# EAGLE design gun (EAGLE 7.4.0)
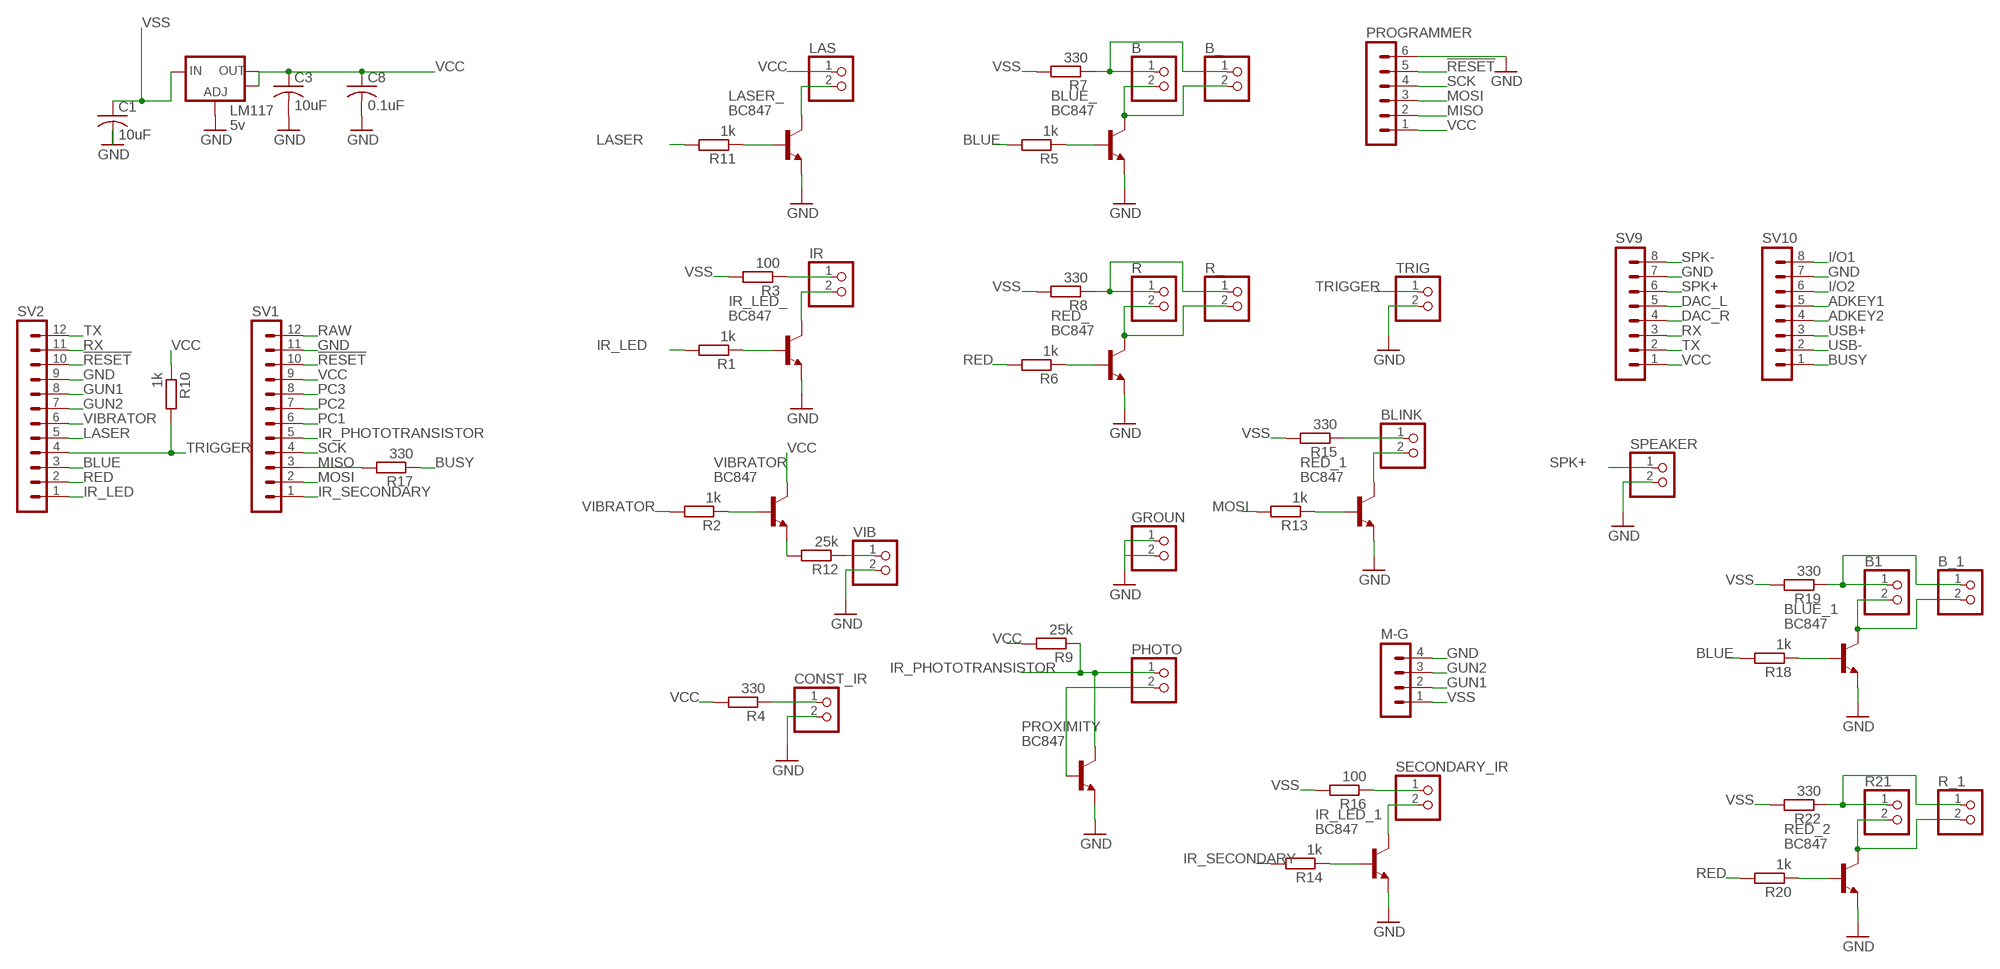
[diagram p0: schematic, sheet 1]

## Parts
B  PINHD-1X2  [1X02]
B1  PINHD-1X2  [1X02]
B_  PINHD-1X2  [1X02]
B_1  PINHD-1X2  [1X02]
BLINK  PINHD-1X2  [1X02]
BLUE_  BC847  [SOT23]
BLUE_1  BC847  [SOT23]
C1  10uF  C-USC0805  [C0805]
C3  10uF  C-USC0805  [C0805]
C8  0.1uF  C-USC0805  [C0805]
CONST_IR  PINHD-1X2  [1X02]
GROUN  PINHD-1X2  [1X02]
IR  PINHD-1X2  [1X02]
IR_LED_  BC847  [SOT23]
IR_LED_1  BC847  [SOT23]
LAS  PINHD-1X2  [1X02]
LASER_  BC847  [SOT23]
LM117  5v  V_REG_LM1117SOT223  [SOT223]
M-G  MA04-1  [MA04-1]
PHOTO  PINHD-1X2  [1X02]
PROGRAMMER  MA06-1  [MA06-1]
PROXIMITY  BC847  [SOT23]
R  PINHD-1X2  [1X02]
R1  1k  R-EU_M1206  [M1206]
R2  1k  R-EU_M1206  [M1206]
R3  100  R-EU_M1206  [M1206]
R4  330  R-EU_M1206  [M1206]
R5  1k  R-EU_M1206  [M1206]
R6  1k  R-EU_M1206  [M1206]
R7  330  R-EU_M1206  [M1206]
R8  330  R-EU_M1206  [M1206]
R9  25k  R-EU_M1206  [M1206]
R10  1k  R-EU_M1206  [M1206]
R11  1k  R-EU_M1206  [M1206]
R12  25k  R-EU_M1206  [M1206]
R13  1k  R-EU_M1206  [M1206]
R14  1k  R-EU_M1206  [M1206]
R15  330  R-EU_M1206  [M1206]
R16  100  R-EU_M1206  [M1206]
R17  330  R-EU_M1206  [M1206]
R18  1k  R-EU_M1206  [M1206]
R19  330  R-EU_M1206  [M1206]
R20  1k  R-EU_M1206  [M1206]
R21  PINHD-1X2  [1X02]
R22  330  R-EU_M1206  [M1206]
R_  PINHD-1X2  [1X02]
R_1  PINHD-1X2  [1X02]
RED_  BC847  [SOT23]
RED_1  BC847  [SOT23]
RED_2  BC847  [SOT23]
SECONDARY_IR  PINHD-1X2  [1X02]
SPEAKER  PINHD-1X2  [1X02]
SV1  MA12-1  [MA12-1]
SV2  MA12-1  [MA12-1]
SV9  MA08-1  [MA08-1]
SV10  MA08-1  [MA08-1]
TRIG  PINHD-1X2  [1X02]
VIB  PINHD-1X2  [1X02]
VIBRATOR  BC847  [SOT23]

## Nets
!RESET: PROGRAMMER.5 SV1.10 SV2.10
ADKEY1: SV10.5
ADKEY2: SV10.4
BLUE: R5.2 R18.2 SV2.3
BUSY: R17.1 SV10.1
DAC_L: SV9.5
DAC_R: SV9.4
GND: BLUE_1.2(E) BLUE_.2(E) C1.2 C3.2 C8.2 CONST_IR.2 GROUN.1 GROUN.2 IR_LED_1.2(E) IR_LED_.2(E) LASER_.2(E) LM117.1(ADJ) M-G.4 PROGRAMMER.6 PROXIMITY.2(E) RED_1.2(E) RED_2.2(E) RED_.2(E) SPEAKER.2 SV1.11 SV2.9 SV9.7 SV10.7 TRIG.2 VIB.2
GUN1: M-G.2 SV2.8
GUN2: M-G.3 SV2.7
I/O1: SV10.8
I/O2: SV10.6
IR_LED: R1.2 SV2.1
IR_PHOTOTRANSISTOR: PHOTO.1 PROXIMITY.3(C) R9.1 SV1.5
IR_SECONDARY: R14.2 SV1.1
LASER: R11.2 SV2.5
MISO: PROGRAMMER.2 R17.2 SV1.3
MOSI: PROGRAMMER.3 R13.2 SV1.2
N$1: PHOTO.2 PROXIMITY.1(B)
N$2: R12.1 VIB.1
N$3: IR_LED_.1(B) R1.1
N$4: R2.1 VIBRATOR.1(B)
N$5: R12.2 VIBRATOR.2(E)
N$6: IR.1 R3.1
N$7: IR.2 IR_LED_.3(C)
N$8: CONST_IR.1 R4.1
N$9: LAS.2 LASER_.3(C)
N$10: R13.1 RED_1.1(B)
N$11: BLUE_.1(B) R5.1
N$12: B.2 B_.2 BLUE_.3(C)
N$13: R6.1 RED_.1(B)
N$14: R.2 R_.2 RED_.3(C)
N$15: B.1 B_.1 R7.1
N$16: R8.1 R.1 R_.1
N$17: BLINK.2 RED_1.3(C)
N$18: BLINK.1 R15.1
N$20: LASER_.1(B) R11.1
N$22: IR_LED_1.1(B) R14.1
N$23: IR_LED_1.3(C) SECONDARY_IR.2
N$24: R16.1 SECONDARY_IR.1
N$25: BLUE_1.1(B) R18.1
N$26: B1.2 B_1.2 BLUE_1.3(C)
N$27: B1.1 B_1.1 R19.1
N$28: R20.1 RED_2.1(B)
N$29: R21.2 R_1.2 RED_2.3(C)
N$30: R21.1 R22.1 R_1.1
PC1: SV1.6
PC2: SV1.7
PC3: SV1.8
RAW: SV1.12
RED: R6.2 R20.2 SV2.2
RX: SV2.11 SV9.3
SCK: PROGRAMMER.4 SV1.4
SPK+: SPEAKER.1 SV9.6
SPK-: SV9.8
TRIGGER: R10.2 SV2.4 TRIG.1
TX: SV2.12 SV9.2
USB+: SV10.3
USB-: SV10.2
VCC: C3.1 C8.1 LAS.1 LM117.2(OUT) LM117.4(OUT) PROGRAMMER.1 R4.2 R9.2 R10.1 SV1.9 SV9.1 VIBRATOR.3(C)
VIBRATOR: R2.2 SV2.6
VSS: C1.1 LM117.3(IN) M-G.1 R3.2 R7.2 R8.2 R15.2 R16.2 R19.2 R22.2

## Library data of the parts
B B1 B_ B_1 BLINK CONST_IR GROUN IR LAS PHOTO R R21 R_ R_1 SECONDARY_IR SPEAKER TRIG VIB = pinhead:PINHD-1X2: PIN HEADER
BLUE_ BLUE_1 IR_LED_ IR_LED_1 LASER_ PROXIMITY RED_ RED_1 RED_2 VIBRATOR = transistor:BC847: NPN TRANSISTOR
C1 C3 C8 = resistor:C-US: CAPACITOR, American symbol
LM117 = SparkFun:V_REG_LM1117: Voltage Regulator LM1117 Standard adjustable voltage regulator but in SMD form. Spark Fun Electronics SKU : COM-00595
M-G = con-lstb:MA04-1: PIN HEADER; OC_FARNELL: unknown; OC_NEWARK: unknown
PROGRAMMER = con-lstb:MA06-1: PIN HEADER; OC_FARNELL: unknown; OC_NEWARK: unknown
R1-R9 R11-R20 R22 = resistor:R-EU_: RESISTOR, European symbol
R10 = rcl:R-EU_: RESISTOR, European symbol
SV1 SV2 = con-lstb:MA12-1: PIN HEADER; OC_FARNELL: unknown; OC_NEWARK: unknown
SV9 SV10 = con-lstb:MA08-1: PIN HEADER; OC_FARNELL: unknown; OC_NEWARK: unknown

## Board
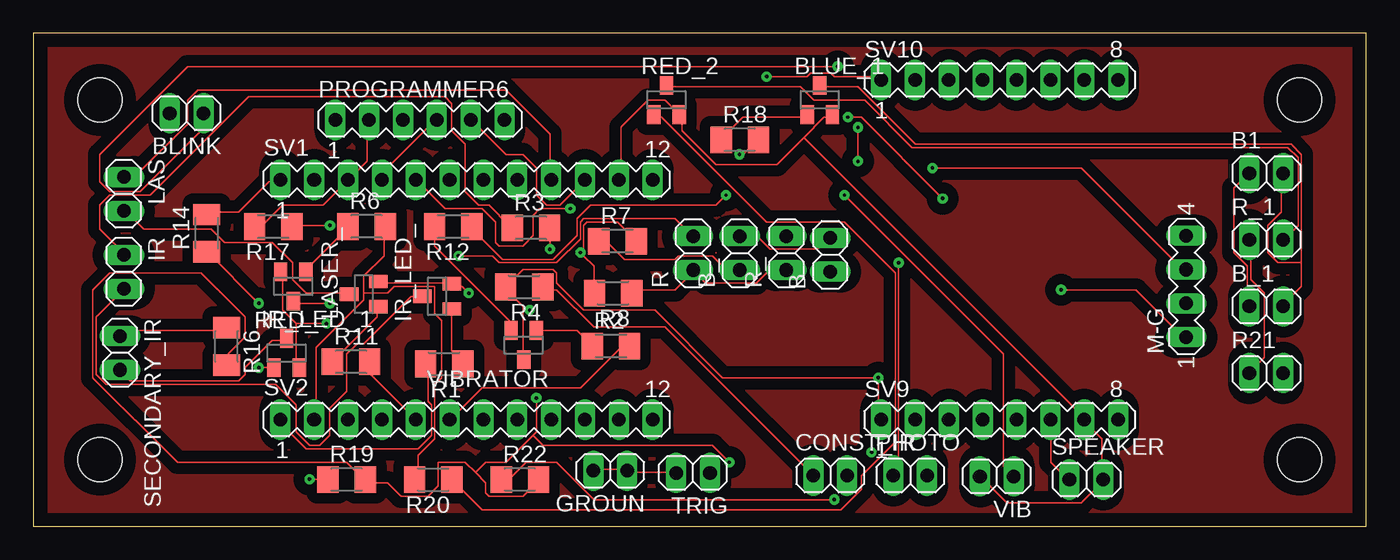
[diagram p1: board, top side]
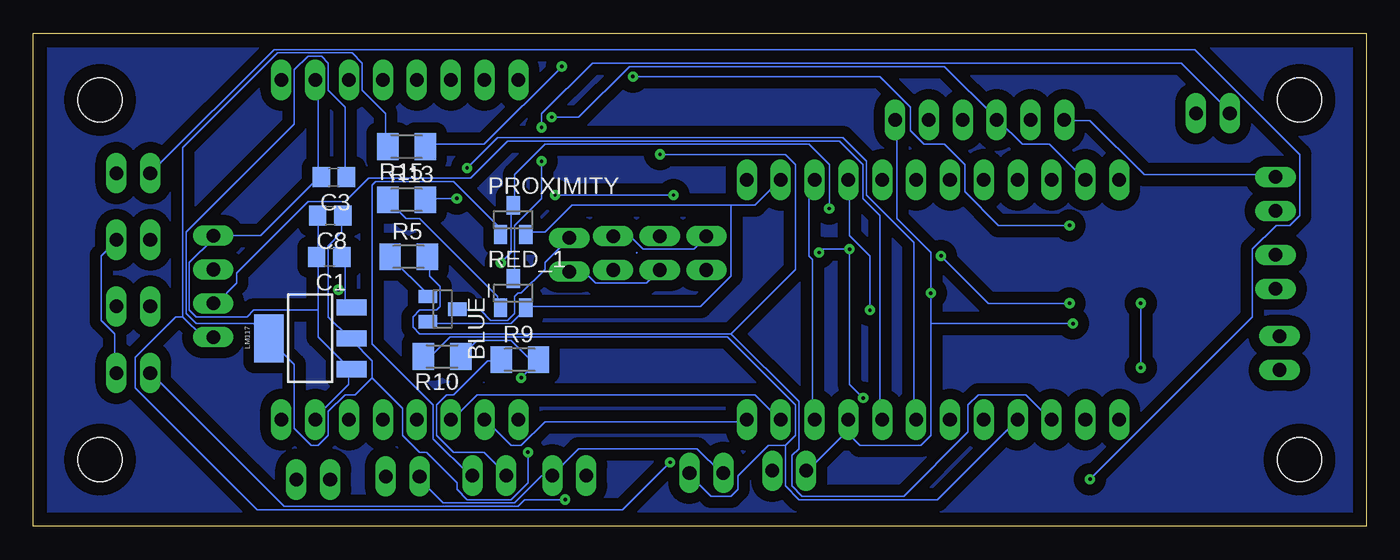
[diagram p2: board, bottom side, seen from below]

Size 100 x 37 mm. Coordinates in mm from the lower left corner, seen from the top.
Outline: 0,0 100,0 100,37 0,37 0,0
Copper layers (1*16): Top 0.035mm / dielectric 1.5mm / Bottom 0.035mm
Design rules "default *": minimum track width 5mil, minimum drill 10mil, track to track 5mil, track to pad 5mil, pad to pad 5mil, via to via 5mil, smd to smd 5mil, copper to edge 40mil, drill to drill 10mil, minimum pad ring 10mil, minimum via ring 10mil, stop-mask expansion 4mil, vias tented up to drill 0mil, thermal gap 10mil
Holes 3.3 mm at 5,32 5,5 95,32 95,5

### Footprints (pad centres in the part's own frame; a part is rotated, then mirrored left to right if it is on the bottom)
1X02 = drill 1.016 long: 1 -1.27,0; 2 1.27,0
SOT23 = smd 1 x 1.4: 1 -0.95,-1.1; 2 0.95,-1.1; 3 0,1.1
C0805 = smd 1.3 x 1.5: 1 -0.95,0; 2 0.95,0
SOT223 = smd 1.219 x 2.235: 1 -2.311,-3.099; 2 0,-3.099; 3 2.311,-3.099 | smd 3.6 x 2.2: 4 0,3.099
MA04-1 = drill 1.016 long: 1 -3.81,0; 2 -1.27,0; 3 1.27,0; 4 3.81,0
MA06-1 = drill 1.016 long: 1 -6.35,0; 2 -3.81,0; 3 -1.27,0; 4 1.27,0; 5 3.81,0; 6 6.35,0
M1206 = smd 1.6 x 2: 1 -1.4,0; 2 1.4,0
MA12-1 = drill 1.016 long: 1 -13.97,0; 2 -11.43,0; 3 -8.89,0; 4 -6.35,0; 5 -3.81,0; 6 -1.27,0; 7 1.27,0; 8 3.81,0; 9 6.35,0; 10 8.89,0; 11 11.43,0; 12 13.97,0
MA08-1 = drill 1.016 long: 1 -8.89,0; 2 -6.35,0; 3 -3.81,0; 4 -1.27,0; 5 1.27,0; 6 3.81,0; 7 6.35,0; 8 8.89,0

### Placement (x,y rotation side)
B  59.79,20.38 90 top
B1  92.5,26.5 0 top
B_  53,20.5 90 top
B_1  92.5,16.5 0 top
BLINK  11.5,31 180 top
BLUE_  69.29,16.3 270 bottom
BLUE_1  59,32 0 top
C1  77.79,20.2 180 bottom
C3  77.45,26.2 180 bottom
C8  77.72,23.32 180 bottom
CONST_IR  59.79,3.81 0 top
GROUN  43.29,4.16 180 top
IR  6.79,19.09 270 top
IR_LED_  30.29,17.26 90 top
IR_LED_1  19,13 0 top
LAS  6.79,24.94 270 top
LASER_  24.79,17.42 90 top
LM117  79.22,14.1 90 bottom
M-G  86.5,18 90 top
PHOTO  65.79,3.81 0 top
PROGRAMMER  29,30.5 0 top
PROXIMITY  64,23 0 bottom
R  49.5,20.5 90 top
R1  30.83,12.18 180 top
R2  43.33,13.52 0 top
R3  37.33,22.39 0 top
R4  36.83,17.96 180 top
R5  71.83,20.22 0 bottom
R6  25,22.5 0 top
R7  43.83,21.4 0 top
R8  43.5,17.5 180 top
R9  63.5,12.5 0 bottom
R10  69.33,12.74 180 bottom
R11  23.83,12.34 0 top
R12  31.5,22.5 180 top
R13  72,24.5 0 bottom
R14  13,22 90 top
R15  72,28.5 180 bottom
R16  14.5,13.5 270 top
R17  18,22.5 180 top
R18  53,29 0 top
R19  23.5,3.5 0 top
R20  30,3.5 180 top
R21  92.5,11.5 0 top
R22  36.5,3.5 0 top
R_  56.5,20.5 90 top
R_1  92.5,21.5 0 top
RED_  19.5,18 180 top
RED_1  64,17.5 0 bottom
RED_2  47.5,32 0 top
SECONDARY_IR  6.5,13 270 top
SPEAKER  79,3.5 0 top
SV1  32.5,26 0 top
SV2  32.5,8 0 top
SV9  72.5,8 0 top
SV10  72.5,33.5 0 top
TRIG  49.5,4 180 top
VIB  72.29,3.74 180 top
VIBRATOR  36.79,13.6 180 top

### Tracks (layer width: path | path; a pad name or v marks a point on that pad's centre or on a via)
!RESET
  Top 0.127: PROGRAMMER.5 32.92,30.45 35.46,27.91 36.73,27.91 37.74,26.89 37.74,24.86 38.5,24.1 39.52,24.1 41.3,25.88 SV1.10
  Bottom 0.127: SV2.10 41.55,8.1 41.55,20.03 41.81,20.29 41.81,25.62 41.55,25.88 SV1.10
BLUE  (via drill 0.25)
  Top 0.127: v52.98,27.91 53.24,27.91 54.25,28.92 R18.2
  Bottom 0.127: 47.65,14.45 71.02,14.45 71.52,14.95 71.52,15.72 71.02,16.22 69.75,16.22 69.49,16.48 69.49,18 70.25,18.76 70.25,20.03 R5.2 | 47.65,14.45 42.57,9.37 42.57,5.81 43.08,5.3 43.08,3.02 42.31,2.25 34.69,2.25 29.87,7.08 29.87,9.11 29.11,9.87 25.55,9.87 23.77,8.1 SV2.3 | v52.98,27.91 43.58,27.91 42.82,27.15 42.82,19.27 47.65,14.45
BUSY  (via drill 0.25)
  Top 0.127: v22.25,22.57 19.45,22.57 R17.1 | v55.01,33.75 58.06,33.75 58.32,34 59.84,34 60.09,33.75 63.4,33.75 SV10.1
  Bottom 0.127: v22.25,22.57 27.58,22.57 30.12,25.11 30.12,27.15 31.65,28.67 33.17,28.67 34.19,29.69 34.19,31.46 36.47,33.75 v55.01,33.75
GND  (via drill 0.25)
  Top 0.127: 19.71,15.21 19.71,11.91 IR_LED_1.2 | 19.71,15.21 18.69,16.22 18.69,19.02 RED_.2 | LASER_.2 26.06,18.26 31.14,18.26 IR_LED_.2 31.39,18 32.15,18 v32.66,17.49 | GROUN.2 42.06,4.29 44.35,4.29 GROUN.1 44.6,4.03 48.16,4.03 TRIG.2 | v21.99,15.21 19.71,15.21 | SV1.11 44.09,26.13 44.09,29.94 46.12,31.97 47.39,31.97 48.41,30.96 RED_2.2 48.66,30.7 48.66,29.69 51.2,27.15 55.78,27.15 57.81,29.18 | 57.81,29.18 59.33,30.7 59.84,30.7 BLUE_1.2 | VIB.2 71.27,3.52 73.05,1.75 78.64,1.75 80.16,3.27 SPEAKER.2 80.16,3.52 80.16,6.57 78.89,7.84 SV9.7 78.89,8.1 57.81,29.18
  Bottom 0.127: 39.01,7.08 39.01,7.84 SV2.9 39.01,7.08 | 39.01,7.08 41.81,4.29 GROUN.2 | 32.66,15.21 32.66,6.83 33.42,6.06 38,6.06 39.01,7.08 | 32.66,15.21 v32.66,17.49 32.66,20.54 35.2,23.08 35.2,30.45 PROGRAMMER.6 | 32.66,15.21 v21.99,15.21 | BLUE_.2 70.25,15.21 64.16,15.21 63.14,16.22 RED_1.2 62.89,16.48 49.93,16.48 47.65,18.76 47.65,24.1 | 47.65,24.1 45.87,24.1 44.09,25.88 SV1.11 | 47.65,24.1 59.59,24.1 61.62,22.07 62.89,22.07 PROXIMITY.2 | SV10.7 78.64,33.5 78.64,26.38 C3.2 78.64,26.13 82.95,21.81 86.26,21.81 M-G.4 86.51,21.56 88.29,19.78 88.29,16.22 87.78,15.72 83.97,15.72 83.46,16.22 78.64,16.22 | C8.2 78.64,23.08 78.64,20.29 C1.2 78.64,20.03 78.64,16.22 | SV9.7 78.89,8.1 76.35,10.64 76.35,11.65 LM117.1 76.35,11.91 78.64,14.19 78.64,16.22 | VIB.2 71.02,3.52 69.24,1.75 63.9,1.75 61.87,3.78 61.11,3.78 CONST_IR.2 60.86,4.03 59.08,5.81 50.19,5.81 48.41,4.03 TRIG.2
GUN1
  Bottom 0.127: SV2.8 36.47,8.1 36.47,23.34 37.74,24.61 37.74,27.15 39.52,28.92 64.41,28.92 67.21,26.13 74.83,26.13 76.6,24.35 79.4,24.35 84.73,19.02 84.73,18.26 86.26,16.73 M-G.2
GUN2  (via drill 0.25)
  Top 0.127: v67.46,26.89 78.64,26.89 86.26,19.27 M-G.3
  Bottom 0.127: v67.46,26.89 65.17,29.18 39.27,29.18 37.49,27.4 37.49,24.86 33.93,21.3 33.93,8.1 SV2.7
IR_LED
  Top 0.127: R1.2 29.61,12.16 29.61,9.37 29.87,9.11 29.87,6.83 28.85,5.81 20.47,5.81 18.44,7.84 SV2.1
IR_PHOTOTRANSISTOR  (via drill 0.25)
  Top 0.127: v64.92,19.78 64.92,4.29 64.67,4.03 PHOTO.1 | v40.28,23.84 38,23.84 37.49,23.34 37.49,21.81 36.73,21.05 34.95,21.05 34.69,21.3 34.69,22.83 33.68,23.84 30.88,23.84 28.85,25.88 SV1.5
  Bottom 0.127: v64.92,19.78 64.16,20.54 64.16,24.1 PROXIMITY.3 63.9,24.35 63.9,26.38 61.62,28.67 41.81,28.67 40.28,27.15 v40.28,23.84 | R9.1 64.92,12.41 65.94,12.41 68.48,9.87 68.98,9.87 69.75,9.11 69.75,6.83 68.48,5.56 66.19,5.56 64.67,4.03 PHOTO.1
IR_SECONDARY
  Top 0.127: R14.2 13.1,23.59 15.39,23.59 17.68,25.88 18.44,25.88 SV1.1
LASER
  Top 0.127: R11.2 25.3,12.16 25.3,11.4 28.6,8.1 SV2.5
MISO
  Top 0.127: R17.2 16.66,22.57 17.17,22.57 18.69,24.1 21.74,24.1 23.52,25.88 SV1.3 23.77,26.13 25.04,27.4 25.04,30.45 PROGRAMMER.2
MOSI  (via drill 0.25)
  Top 0.127: v68.22,24.61 62.13,30.7 v61.11,30.7
  Bottom 0.127: v68.22,24.61 70.51,24.61 R13.2 | v61.11,30.7 59.08,30.7 55.27,34.51 31.65,34.51 27.84,30.7 PROGRAMMER.3 27.58,30.45 25.8,28.67 23.77,28.67 21.23,26.13 SV1.2
N$1
  Bottom 0.127: PROXIMITY.1 65.17,22.07 65.17,22.57 68.48,25.88 74.32,25.88 74.57,25.62 74.57,13.68 70,9.11 70,6.57 67.21,3.78 PHOTO.2
N$2  (via drill 0.25)
  Top 0.127: v51.97,24.86 51.2,24.1 41.81,24.1 40.79,23.08 40.79,21.81 39.01,20.03 35.2,20.03 32.92,22.32 R12.1 | v60.86,24.86 72.79,12.92 72.79,4.54 73.56,3.78 VIB.1
  Bottom 0.127: v60.86,24.86 v51.97,24.86
N$3
  Top 0.127: IR_LED_.1 31.39,16.22 31.39,13.18 32.15,12.41 R1.1
N$4
  Top 0.127: VIBRATOR.1 40.79,14.7 41.81,13.68 R2.1
N$5
  Top 0.127: VIBRATOR.2 35.71,14.7 35.71,15.46 30.12,21.05 30.12,22.32 R12.2
N$6
  Top 0.127: R3.1 35.71,22.57 34.19,24.1 33.42,24.1 32.41,25.11 32.41,28.67 31.39,29.69 31.39,31.72 30.88,32.23 16.15,32.23 8.79,24.86 5.74,24.86 4.98,24.1 4.98,22.32 6.75,20.54 IR.1
N$7
  Top 0.127: IR_LED_.3 29.11,17.24 28.34,17.24 24.79,13.68 24.28,13.68 23.52,12.92 23.52,10.13 22.25,8.86 22.25,6.83 21.49,6.06 20.72,6.06 19.71,7.08 19.71,9.11 18.18,10.64 5.48,10.64 4.72,11.4 4.72,15.72 6.75,17.75 IR.2
N$8
  Top 0.127: R4.1 38.25,17.75 39.27,17.75 42.06,14.95 47.39,14.95 58.32,4.03 CONST_IR.1
N$9
  Top 0.127: LASER_.3 23.52,17.49 20.47,17.49 19.45,18.51 19.45,19.78 17.93,21.3 14.37,21.3 13.36,22.32 8.28,22.32 7.01,23.59 LAS.2
N$10
  Bottom 0.127: RED_1.1 65.17,16.48 65.17,17.24 71.02,23.08 72.03,23.08 73.3,24.35 R13.1
N$11
  Bottom 0.127: BLUE_.1 70.51,17.49 73.05,20.03 R5.1
N$12
  Top 0.127: B_.2 53.24,21.56 54.51,21.56 55.27,20.8 58.82,20.8 59.59,21.56 B.2
  Bottom 0.127: BLUE_.3 67.97,16.22 66.44,16.22 65.68,15.46 64.41,15.46 63.9,15.97 63.9,17.24 63.65,17.49 63.4,17.49 61.62,19.27 61.62,19.78 59.84,21.56 B.2
N$13
  Top 0.127: RED_.1 20.47,19.27 23.52,22.32 R6.1
N$14  (via drill 0.25)
  Top 0.127: v22.25,16.73 19.71,16.73 RED_.3 | v31.9,20.29 34.44,20.29 34.95,19.78 39.27,19.78 41.04,21.56 41.04,22.83 41.3,23.08 48.16,23.08 49.43,21.81 R.2
  Bottom 0.127: v22.25,16.73 28.34,16.73 v31.9,20.29 | R_.2 56.28,21.56 55.01,21.56 54.25,20.8 50.44,20.8 49.68,21.56 R.2
N$15
  Top 0.127: R7.1 42.57,21.3 43.08,21.3 44.35,20.03 48.16,20.03 48.41,20.29 50.95,20.29 51.97,19.27 52.98,19.27 B_.1
  Bottom 0.127: B.1 59.59,19.02 58.57,19.02 57.81,18.26 54,18.26 53.24,19.02 B_.1
N$16
  Top 0.127: R8.1 45.11,17.75 48.16,17.75 49.43,19.02 R.1 49.68,19.02 50.44,18.26 54.25,18.26 55.01,19.02 56.28,19.02 R_.1
N$17  (via drill 0.25)
  Top 0.127: v61.87,29.94 v61.87,27.4
  Bottom 0.127: v61.87,27.4 61.87,24.61 63.9,22.57 63.9,18.76 RED_1.3 | v61.87,29.94 61.87,30.96 58.06,34.77 13.87,34.77 10.31,31.21 BLINK.2
N$18  (via drill 0.25)
  Top 0.127: v60.35,34.51 11.58,34.51 4.98,27.91 4.98,25.88 5.74,25.11 8.02,25.11 12.6,29.69 12.6,30.96 BLINK.1
  Bottom 0.127: v60.35,34.51 66.19,28.67 70.51,28.67 R15.1
N$19
  Top 0.127: 51.2,20.54 51.22,20.5
N$20
  Top 0.127: LASER_.1 25.8,16.22 25.8,15.72 22.5,12.41 R11.1
N$21
  Bottom 0.127: 54.76,20.54 54.72,20.5
N$22  (via drill 0.25)
  Top 0.127: v16.91,11.91 17.93,11.91 IR_LED_1.1 | v16.91,16.73 13.1,20.54 R14.1
  Bottom 0.127: v16.91,16.73 v16.91,11.91
N$23
  Top 0.127: IR_LED_1.3 18.95,13.94 17.93,13.94 15.9,11.91 15.9,11.4 15.39,10.89 7.26,10.89 6.5,11.65 SECONDARY_IR.2
N$24
  Top 0.127: R16.1 14.37,14.7 6.75,14.7 6.5,14.45 SECONDARY_IR.1
N$25
  Top 0.127: BLUE_1.1 57.81,30.7 53.24,30.7 51.71,29.18 R18.1
N$26
  Top 0.127: 95.15,19.78 95.15,18 93.88,16.73 B_1.2 | 95.15,19.78 95.15,27.91 94.38,28.67 66.19,28.67 61.87,32.99 59.08,32.99 BLUE_1.3 | 95.15,19.78 93.37,19.78 92.61,20.54 92.61,22.57 93.62,23.59 93.62,26.38 B1.2
N$27  (via drill 0.25)
  Top 0.127: v20.72,3.52 21.99,3.52 R19.1 | B_1.1 91.08,16.73 91.08,19.53 90.07,20.54 90.07,25.37 91.08,26.38 B1.1
  Bottom 0.127: v20.72,3.52 8.53,15.72 8.53,20.8 6.75,22.57 5.74,22.57 4.98,23.34 4.98,27.91 12.85,35.78 81.94,35.78 91.08,26.64 B1.1
N$28
  Top 0.127: RED_2.1 46.63,30.7 47.14,30.7 55.01,22.83 60.86,22.83 64.67,19.02 64.67,6.32 62.13,3.78 62.13,2.76 60.6,1.24 33.68,1.24 31.65,3.27 R20.1
N$29
  Top 0.127: RED_2.3 47.65,32.99 57.55,32.99 58.57,31.97 62.38,31.97 65.94,28.42 94.13,28.42 94.89,27.65 94.89,22.57 93.88,21.56 R_1.2
  Bottom 0.127: R21.2 93.88,11.65 93.88,14.45 94.89,15.46 94.89,20.29 93.88,21.3 R_1.2
N$30  (via drill 0.25)
  Top 0.127: v60.09,2 42.06,2 39.27,4.79 36.98,4.79 35.71,3.52 35.2,3.52 R22.1 | R_1.1 91.34,21.3 91.34,18.51 92.35,17.49 92.35,12.67 91.34,11.65 R21.1
  Bottom 0.127: v60.09,2 63.14,2 63.65,1.49 81.18,1.49 91.08,11.4 R21.1
N$31
  pour Top (isolate 0.813): 0.5,36.5 0.5,0.5 99.5,0.5 99.5,36.5
N$32
  pour Bottom (isolate 0.813): 0.5,36.5 0.5,0.5 99.5,0.5 99.5,36.5
RED
  Top 0.127: 24.79,17.49 24.79,16.99 21.23,13.43 21.23,8.1 SV2.2 | 24.79,17.49 24.79,18.76 26.31,20.29 26.31,22.32 R6.2 | 24.79,17.49 26.57,17.49 27.07,18 30.12,18 30.12,15.97 30.63,15.46 30.63,11.14 30.12,10.64 30.12,6.57 28.85,5.3 28.85,3.52 R20.2
RX
  Bottom 0.127: SV2.11 44.09,8.1 45.87,9.87 66.7,9.87 68.48,8.1 SV9.3
SCK
  Top 0.127: SV1.4 26.31,26.13 26.31,26.64 30.12,30.45 PROGRAMMER.4
SPK+
  Top 0.127: SV9.6 76.35,7.84 76.35,4.79 77.62,3.52 SPEAKER.1
TRIGGER
  Bottom 0.127: 43.58,6.06 42.82,6.83 42.82,9.11 47.9,14.19 68.73,14.19 70,12.92 70.51,12.92 R10.2 | 43.58,6.06 44.85,6.06 47.14,3.78 47.14,2.76 47.65,2.25 49.17,2.25 50.7,3.78 TRIG.1 | 43.58,6.06 43.58,3.02 42.57,2 32.15,2 26.31,7.84 SV2.4
TX
  Bottom 0.127: SV2.12 46.63,7.84 61.62,7.84 63.4,6.06 64.16,6.06 65.94,7.84 SV9.2
VCC  (via drill 0.25)
  Top 0.127: 36.73,16.22 36.73,16.48 35.46,17.75 R4.2 35.46,18 36.73,19.27 39.01,19.27 39.27,19.02 39.27,18.26 41.3,16.22 46.63,16.22 51.71,11.14 v63.4,11.14 63.4,8.1 SV9.1 63.4,7.84 62.89,7.33 v62.89,5.56 | 36.73,16.22 36.73,12.67 VIBRATOR.3 | 36.73,16.22 v37.23,16.22 | LAS.1 7.01,26.38 7.77,26.38 11.58,30.19 11.58,31.97 12.34,32.73 35.46,32.73 38.76,29.43 38.76,26.13 SV1.9
  Bottom 0.127: C8.1 76.86,23.08 76.86,22.07 77.87,21.05 77.87,15.72 76.35,14.19 LM117.2 76.1,13.94 74.57,12.41 74.57,11.14 | C3.1 76.6,26.38 76.6,31.46 77.87,32.73 77.87,34.77 78.38,35.27 79.4,35.27 80.41,34.26 80.41,30.19 88.54,22.07 88.54,15.97 87.78,15.21 83.46,15.21 82.45,14.19 LM117.4 82.19,13.94 80.41,12.16 80.41,7.33 79.14,6.06 78.64,6.06 77.87,6.83 77.87,8.6 76.6,9.87 75.84,9.87 74.57,11.14 | LAS.1 7.01,26.38 16.66,26.38 20.72,30.45 22.5,30.45 PROGRAMMER.1 | R10.1 67.71,12.92 66.7,13.94 64.16,13.94 62.89,12.67 62.13,12.67 R9.2 62.13,12.41 v63.4,11.14 | v37.23,16.22 37.23,20.29 38.76,21.81 38.76,25.88 SV1.9 | 74.57,11.14 72.29,8.86 72.29,6.83 71.02,5.56 70.51,5.56 68.22,3.27 68.22,2.76 67.46,2 64.16,2 62.89,3.27 v62.89,5.56
VIBRATOR
  Top 0.127: R2.2 44.6,13.43 44.09,13.43 41.04,10.38 33.68,10.38 31.39,8.1 SV2.6
VSS  (via drill 0.25)
  Top 0.127: v77.11,17.75 82.7,17.75 86.26,14.19 M-G.1 | 41.3,20.54 41.3,22.57 41.55,22.83 43.84,22.83 45.11,21.56 R7.2 | 41.3,20.54 41.3,20.29 42.06,19.53 42.06,17.75 R8.2 | v38.76,20.8 38.76,22.32 R3.2 | 41.3,20.54 v41.04,20.54 | 33.17,4.03 33.93,3.27 33.93,2.51 34.19,2.25 36.73,2.25 37.74,3.27 R22.2 | 33.17,4.03 32.41,4.79 30.38,4.79 30.38,3.02 29.61,2.25 27.58,2.25 26.57,3.27 25.04,3.27 R19.2 24.79,3.52 23.52,4.79 10.82,4.79 4.47,11.14 4.47,17.75 5.74,19.02 12.6,19.02 15.9,15.72 15.9,14.19 14.63,12.92 14.63,12.16 R16.2 | v37.74,9.62 37.74,7.08 37.49,6.83 | 37.49,6.83 35.46,4.79 33.93,4.79 33.17,4.03 | v52.22,4.79 50.95,6.06 38.25,6.06 37.49,6.83
  Bottom 0.127: 76.6,17.75 76.6,16.73 76.35,16.48 LM117.3 | 76.6,17.75 76.6,20.03 C1.1 | 88.8,15.72 88.8,28.42 81.68,35.53 76.1,35.53 75.33,34.77 75.33,32.73 73.56,30.96 73.56,28.67 R15.2 | 88.8,15.72 87.27,14.19 M-G.1 | v77.11,17.75 76.6,17.75 | v41.04,20.54 40.79,20.8 v38.76,20.8 38.76,10.64 v37.74,9.62 | 88.8,15.72 89.3,15.72 92.35,12.67 92.35,10.38 83.21,1.24 55.78,1.24 v52.22,4.79